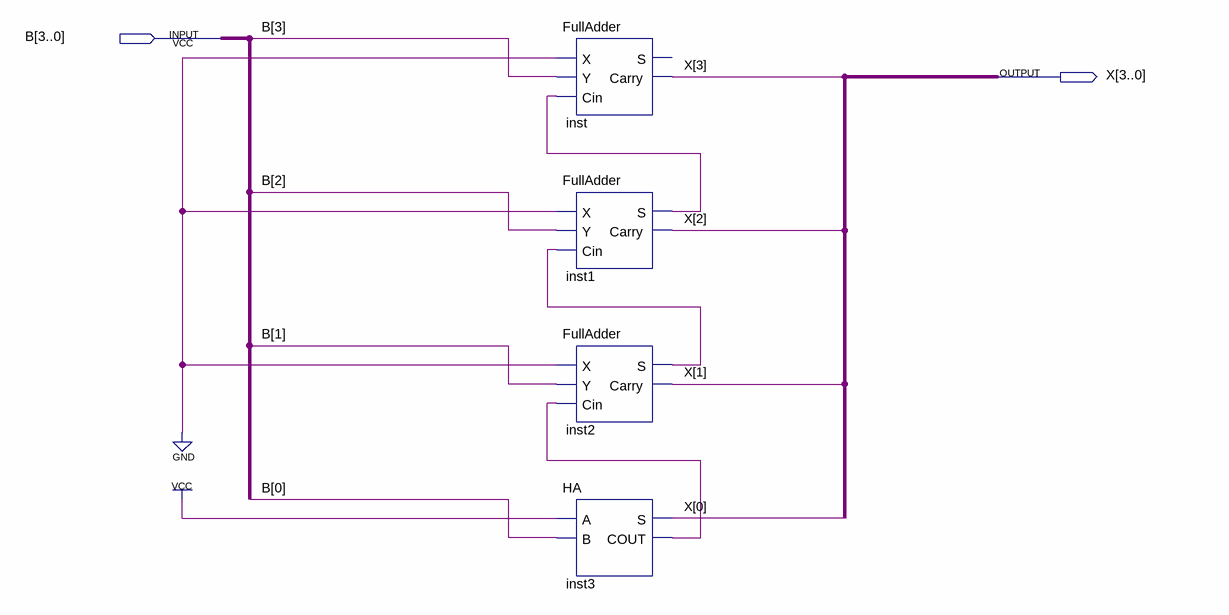
[diagram p0: schematic sheet]
// Quartus schematic BU2.bdf as structural Verilog: 4 symbols, 2 pins
module BU2 (
  input  [3:0] B,
  output [3:0] X
);

  wire inst1_s, inst2_s, inst3_cout;

  FullAdder inst (.X(1'b0), .Y(B[3]), .Cin(inst1_s), .Carry(X[3]));  // open: S
  FullAdder inst1 (.X(1'b0), .Y(B[2]), .Cin(inst2_s), .S(inst1_s), .Carry(X[2]));
  FullAdder inst2 (.X(1'b0), .Y(B[1]), .Cin(inst3_cout), .S(inst2_s), .Carry(X[1]));
  HA inst3 (.A(1'b1), .B(B[0]), .S(X[0]), .COUT(inst3_cout));
endmodule
